# Altium project Sensor_PCB_S201.PrjPcb
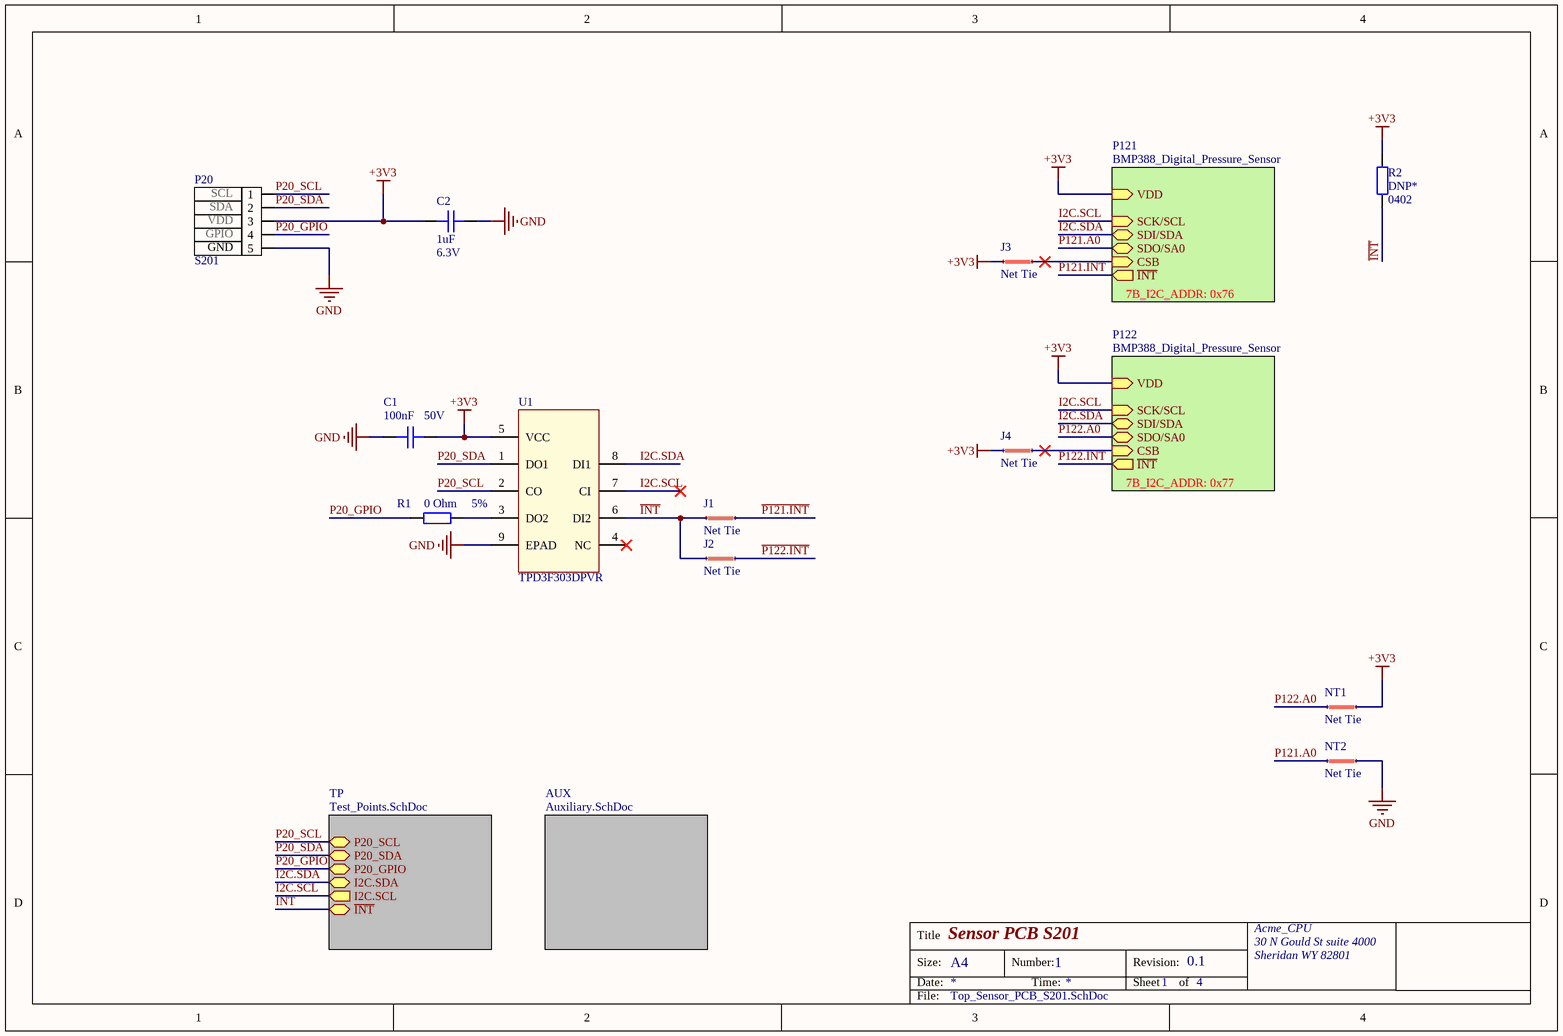
[diagram p0: Top_Sensor_PCB_S201.SchDoc]
_address1: 30 N Gould St suite 4000; _address2: Sheridan WY 82801; _ApprovedBy: PGU; _BoardName: Sensor_PCB; _CompanyName: Acme_CPU; _DateCode: 2020.30; _DocumentDate: 20201207; _HWEngineer: SGU; _PCBModel: S201; _PCBNumber: 001; _Revision: 0.1; _Title: Sensor_PCB; CompanyName: Acme CPU; Title: Sensor Board S201
3 sheets, 28 parts. Net scope: hierarchical (ports join the sheet entries above them; power ports are global).
Board files: Sensor_PCB_S201_Flex.PcbDoc, Sensor_PCB_S201_Flex_Sourav.PcbDoc
Sheets:
  Top_Sensor_PCB_S201.SchDoc
    TP = Test_Points.SchDoc
    AUX = Auxiliary.SchDoc

## Sheet Top_Sensor_PCB_S201.SchDoc: Sensor PCB S201
size A4; DocumentNumber: 1; SheetNumber: 1; SheetTotal: 4

### Parts
C1  Capacitance: 100nF  Voltage: 50V  [C0402]  (hidden comment: CAP CER 0.1UF 50V X7R 0402)
C2  Capacitance: 1uF  Voltage Rating: 6.3V  [C0402]  (hidden comment: CAP CER 1UF 6.3V X5R 0402)
J1  Net Tie  [Net Tie 6x30mil]  (net tie, no BOM)
J2  Net Tie  [Net Tie 6x30mil]  (net tie, no BOM)
J3  Net Tie  [Net Tie 6x30mil]  (net tie, no BOM)
J4  Net Tie  [Net Tie 6x30mil]  (net tie, no BOM)
NT1  Net Tie  [Net Tie 6x30mil]  (net tie, no BOM)
NT2  Net Tie  [Net Tie 6x30mil]  (net tie, no BOM)
P20  S201  pin_1: SCL  pin_2: SDA  pin_3: VDD  pin_4: GPIO  pin_5: GND  [5-PIN FPC BOARD EDGE CONNECTOR 0.5MM]
R1  Tolerance: 5%  Resistance: 0 Ohm  [R0402]  (hidden comment: RES SMD 0 OHM JUMPER 1/16W 0402)
R2  DNP*  Case/Package: 0402  [R0402]  (no BOM)
U1  TPD3F303DPVR  [DPV8_1P7X0P4]

### Sub-sheets
AUX = Auxiliary.SchDoc: no entries
P121 = BMP388_Digital_Pressure_Sensor (file not in this document): VDD (in), SCK/SCL (in), SDI/SDA (bidir), SDO/SA0 (bidir), CSB (in), ~{INT} (out)  | 7B_I2C_ADDR: 0x76
P122 = BMP388_Digital_Pressure_Sensor (file not in this document): VDD (in), SCK/SCL (in), SDI/SDA (bidir), SDO/SA0 (bidir), CSB (in), ~{INT} (out)  | 7B_I2C_ADDR: 0x77
TP = Test_Points.SchDoc: P20_SCL, P20_SDA, P20_GPIO, I2C.SDA (bidir), I2C.SCL (out), ~{INT}

### Nets
+3V3: C1.1 C2.2 J3.1 J4.1 NT1.2 P20.3 R2.2 U1.5(VCC) ; sheet P121/VDD, sheet P122/VDD
GND: C1.2 C2.1 NT2.2 P20.5 U1.9(EPAD)
~{INT}: J1.1 J2.1 R2.1 U1.6(DI2) ; sheet TP/~{INT}
~{P121.INT}: J1.2 ; sheet P121/~{INT}
~{P122.INT}: J2.2 ; sheet P122/~{INT}
I2C.SCL: U1.7(CI) ; sheet TP/I2C.SCL, sheet P121/SCK/SCL, sheet P122/SCK/SCL
I2C.SDA: U1.8(DI1) ; sheet TP/I2C.SDA, sheet P121/SDI/SDA, sheet P122/SDI/SDA
P20_GPIO: P20.4 R1.2 ; sheet TP/P20_GPIO
P20_SCL: P20.1 U1.2(CO) ; sheet TP/P20_SCL
P20_SDA: P20.2 U1.1(DO1) ; sheet TP/P20_SDA
P121.A0: NT2.1 ; sheet P121/SDO/SA0
P122.A0: NT1.1 ; sheet P122/SDO/SA0
NetJ3_2: J3.2 ; sheet P121/CSB
NetJ4_2: J4.2 ; sheet P122/CSB
NetR1_1: R1.1 U1.3(DO2)

Not connected (* = marked no-connect by the designer): U1 4(NC)*

### Notes on the sheet
- Title
- Size:
- Date:
- A4
- Number:
- Time:
- Revision:
- Sheet
- of
- File:

### Library data of the parts
C1 = CAP CER 0.1UF 50V X7R 0402: 0.1µF ±10% 50V Ceramic Capacitor X7R 0402 (1005 Metric); Manufacturer: TDK; Manufacturer Part Number: CGA2B3X7R1H104K050BB; Supplier 1: Digi-Key; Stock 1: 2925303; Pricing 1: 1=0.17, 10=0.118, 50=0.0668, 100=0.0553, 500=0.0388, 1000=0.0321, 2500=0.0299, 5000=0.0273 (USD); Mount: Surface Mount; Case/Package: 0402; Weight: 2.3E-05oz; Case Code (Metric): 1005; Case Code (Imperial): 0402; Min Operating Temperature: -55°C; Max Operating Temperature: 125°C; Voltage Rating: 50V; Tolerance: 10%; Packaging: Tape and Reel; Package Quantity: 1; Voltage Rating (DC): 50V; Dielectric: X7R; Termination: SMD/SMT; Composition: Ceramic; Length: 1mm; Height: 0.5mm; Width: 0.02inch; Thickness: 0.022inch; Depth: 0.5mm; Ratings: AEC-Q200; REACH SVHC: No SVHC; Lead Free: Lead Free; ComponentLink1URL: http://product.tdk.com/capacitor/mlcc/en/documents/mlccspec_automotive_general_midvoltage_en.pdf?src-supplier=Future+Electronics; ComponentLink1Description: http://product.tdk.com/capacitor/mlcc/en/documents/mlccspec_automotive_general_midvoltage_en.pdf?src-supplier=Future+Electronics; ComponentLink2URL: http://www.farnell.com/datasheets/1807242.pdf?src-supplier=Element14; ComponentLink2Description: http://www.farnell.com/datasheets/1807242.pdf?src-supplier=Element14; ComponentLink3URL: http://www.mouser.com/ds/2/400/lcc_automotive_general_en-843974.pdf?src-supplier=Mouser; ComponentLink3Description: http://www.mouser.com/ds/2/400/lcc_automotive_general_en-843974.pdf?src-supplier=Mouser; ComponentLink4URL: http://www.farnell.com/datasheets/1936565.pdf?src-supplier=Element14; ComponentLink4Description: http://www.farnell.com/datasheets/1936565.pdf?src-supplier=Element14; ComponentLink5URL: http://www.farnell.com/datasheets/1735392.pdf?src-supplier=Element14; ComponentLink5Description: http://www.farnell.com/datasheets/1735392.pdf?src-supplier=Element14; Supplier Part Number 1: 445-6899-1-ND
C2 = CAP CER 1UF 6.3V X5R 0402: 1µF ±10% 6.3V Ceramic Capacitor X5R 0402 (1005 Metric); Manufacturer: Yageo; Manufacturer Part Number: CC0402KRX5R5BB105; Supplier 1: Digi-Key; Stock 1: 34926286; Pricing 1: 1=0.1, 10=0.05, 50=0.0272, 100=0.0222, 500=0.0158, 1000=0.0124, 2500=0.0113, 5000=0.0104 (USD); Mount: Surface Mount; Number of Pins: 2; Case Code (Imperial): 0402; Case Code (Metric): 1005; Min Operating Temperature: -55°C; Max Operating Temperature: 85°C; Tolerance: 10%; Packaging: Tape and Reel; Termination: SMD/SMT; Voltage Rating (DC): 6.3V; Composition: Ceramic; Length: 1mm; Height: 0.5mm; Width: 0.02inch; Thickness: 0.022inch; Depth: 0.5mm; Radiation Hardening: No; Lead Free: Lead Free; Halogen Free: Halogen Free; ComponentLink1URL: http://www.farnell.com/datasheets/70765.pdf?src-supplier=Farnell; ComponentLink1Description: http://www.farnell.com/datasheets/70765.pdf?src-supplier=Farnell; Supplier Part Number 1: 311-1438-1-ND; Dielectric: X5R; Case/Package: 0402; Dielectric Material: Ceramic; Package Quantity: 1; REACH SVHC: No SVHC; ComponentLink2URL: http://www.yageo.com/documents/recent/UPY-GPHC_X5R_4V-to-50V_25.pdf?src-supplier=Digi-Key; ComponentLink2Description: http://www.yageo.com/documents/recent/UPY-GPHC_X5R_4V-to-50V_25.pdf?src-supplier=Digi-Key; ComponentLink3URL: http://www.farnell.com/datasheets/2167237.pdf?src-supplier=Element14; ComponentLink3Description: http://www.farnell.com/datasheets/2167237.pdf?src-supplier=Element14; ComponentLink4URL: http://www.yageo.com/documents/recent/UPY-GPHC_X5R_4V-to-50V_12.pdf?src-supplier=Avnet+Europe; ComponentLink4Description: http://www.yageo.com/documents/recent/UPY-GPHC_X5R_4V-to-50V_12.pdf?src-supplier=Avnet+Europe; ComponentLink5URL: http://www.farnell.com/datasheets/1359354.pdf?src-supplier=Element14; ComponentLink5Description: http://www.farnell.com/datasheets/1359354.pdf?src-supplier=Element14; ComponentLink6URL: http://www.farnell.com/datasheets/70765.pdf?src-supplier=Element14; ComponentLink6Description: http://www.farnell.com/datasheets/70765.pdf?src-supplier=Element14; ComponentLink7URL: http://www.yageo.com/documents/recent/UPY-GPHC_X5R_4V-to-50V_12.pdf?src-supplier=Avnet; ComponentLink7Description: http://www.yageo.com/documents/recent/UPY-GPHC_X5R_4V-to-50V_12.pdf?src-supplier=Avnet
J1-J4 NT1 NT2 = Net Tie Line
  J1-J4: ClassName: Net Tie
  NT1: ClassName: P122
  NT2: ClassName: P121
P20 = CONN HEADER TH R/A 5POS 1.5MM: Connector Header Through Hole, Right Angle 5 position 0.059" (1.50mm); Manufacturer: JST; Manufacturer Part Number: S5B-ZR(LF)(SN); Number of Positions: 5; Gender: Male; Pitch: 1.5mm; Connector Type: Male Pin; Current Rating: 1A; Voltage Rating: 50V; Contact Resistance: 30mR; Supplier 1: Digi-Key; Stock 1: 41138; Pricing 1: 1=0.29, 10=0.272, 100=0.1889, 500=0.1598, 1000=0.1308, 5000=0.1162, 10000=0.1053 (USD); Mount: Through Hole; Housing Material: Polyamide; Contact Plating: Tin,Copper; Color: Natural; Min Operating Temperature: -25°C; Max Operating Temperature: 85°C; Number of Rows: 1; Packaging: Bulk; Termination: Press-Fit; Orientation: Right Angle; Number of Contacts: 5; ComponentLink1URL: http://www.jst-mfg.com/product/pdf/eng/eZH.pdf?src-supplier=Digi-Key; ComponentLink1Description: http://www.jst-mfg.com/product/pdf/eng/eZH.pdf?src-supplier=Digi-Key; Supplier Part Number 1: 455-1672-ND; Housing Color: Beige; Fastening Type: Detent; Length: 9mm; Depth: 6mm; Contact Mating Length: 0.094inch; Number of Pins: 5; Contact Material: Brass,Tin; Max Current Rating: 1A; Max Voltage Rating (AC): 50V; Height: 7.2mm; Width: 3.5mm; Lead Free: Lead Free; ComponentLink2URL: https://www.verical.com/server-webapp/html/getDatasheet?partID=640593&src-supplier=Verical; ComponentLink2Description: https://www.verical.com/server-webapp/html/getDatasheet?partID=640593&src-supplier=Verical; ComponentLink3URL: http://www1.futureelectronics.com/doc/JST/S5B-ZR(LF)(SN).pdf?src-supplier=Future+Electronics; ComponentLink3Description: http://www1.futureelectronics.com/doc/JST/S5B-ZR(LF)(SN).pdf?src-supplier=Future+Electronics; ComponentLink4URL: http://www.produktinfo.conrad.com/datenblaetter/725000-749999/741204-da-01-en-STIFTLEISTE_GEWINKELT_5_POL_RM1_5.pdf?src-supplier=Conrad; ComponentLink4Description: http://www.produktinfo.conrad.com/datenblaetter/725000-749999/741204-da-01-en-STIFTLEISTE_GEWINKELT_5_POL_RM1_5.pdf?src-supplier=Conrad
R1 = RES SMD 0 OHM JUMPER 1/16W 0402: 0 Ohms Jumper 0.063W, 1/16W Chip Resistor 0402 (1005 Metric) Moisture Resistant Thick Film; Manufacturer: Yageo; Manufacturer Part Number: RC0402JR-070RL; Power Rating: 62.5mW; Voltage Rating: 50V; Max Power Dissipation: 63mW; Temperature Coefficient: 200ppm/°C; Supplier 1: Digi-Key; Stock 1: 46057148; Pricing 1: 1=0.1, 10=0.013, 25=0.0092, 50=0.0072, 100=0.0053, 250=0.004, 500=0.0032, 1000=0.0024, 5000=0.0017 (USD); Contact Plating: Tin,Matte; Case Code (Metric): 1005; Case Code (Imperial): 0402; Min Operating Temperature: -55°C; Max Operating Temperature: 155°C; Packaging: Tape and Reel; Composition: Thick Film; Package Quantity: 1; Number of Terminations: 2; Termination: SMD/SMT; Military Standard: Not; Features: Moisture Resistant; Length: 1mm; Height: 0.016inch; Width: 0.02inch; Depth: 0.5mm; Radiation Hardening: No; REACH SVHC: Unknown; Lead Free: Lead Free; ComponentLink1URL: http://www.yageo.com/documents/recent/PYu-RC_Group_51_RoHS_L_10.pdf?src-supplier=Digi-Key; ComponentLink1Description: http://www.yageo.com/documents/recent/PYu-RC_Group_51_RoHS_L_10.pdf?src-supplier=Digi-Key; ComponentLink2URL: http://www.yageo.com/documents/recent/PYu-RC0402_51_RoHS_L_6.pdf?src-supplier=Avnet+Europe; ComponentLink2Description: http://www.yageo.com/documents/recent/PYu-RC0402_51_RoHS_L_6.pdf?src-supplier=Avnet+Europe; ComponentLink3URL: http://www.farnell.com/datasheets/1018594.pdf?src-supplier=Element14; ComponentLink3Description: http://www.farnell.com/datasheets/1018594.pdf?src-supplier=Element14; ComponentLink4URL: https://www.verical.com/server-webapp/html/getDatasheet?partID=326379&src-supplier=Verical; ComponentLink4Description: https://www.verical.com/server-webapp/html/getDatasheet?partID=326379&src-supplier=Verical; ComponentLink5URL: http://www.farnell.com/datasheets/2167052.pdf?src-supplier=Element14; ComponentLink5Description: http://www.farnell.com/datasheets/2167052.pdf?src-supplier=Element14; Supplier Part Number 1: 311-0.0JRCT-ND; Case/Package: 0402
R2 = RES SMD NO BOM 0402: Placeholder for a 0402 resistor
U1 = FILTER RC(PI) ESD SMD  8-UFDFN EP: RC (Pi) EMI Filter 2nd Order Low Pass 3 Channel R = 47Ohms, 100Ohms, C = 20pF  8-UFDFN Exposed Pad; Manufacturer: Texas Instruments; Number of Channels: 3; Operating Supply Voltage: 5.5V; ESD Protection: Yes; Clamping Voltage: 10V; Frequency: 308MHz; Supplier 1: Digi-Key; Manufacturer Part Number: TPD3F303DPVR; Stock 1: 4896; Pricing 1: 1=0.85, 10=0.812, 25=0.7856, 50=0.6414, 100=0.576, 250=0.5236, 500=0.4974, 1000=0.4451 (USD); Case/Package: SMD/SMT; Number of Pins: 8; Contact Plating: Gold; Min Operating Temperature: -40°C; Max Operating Temperature: 85°C; Package Quantity: 1; Packaging: Tape and Reel; Capacitance: 20pF; Termination: Flat; Length: 2.2mm; Height: 0.026inch; Width: 0.063inch; Depth: 1.7mm; Radiation Hardening: No; REACH SVHC: No SVHC; Lead Free: Lead Free; ComponentLink1URL: http://www.ti.com/lit/ds/symlink/tpd3f303.pdf?src-supplier=Digi-Key; ComponentLink1Description: http://www.ti.com/lit/ds/symlink/tpd3f303.pdf?src-supplier=Digi-Key; ComponentLink2URL: http://focus.ti.com/lit/ds/symlink/tpd3f303.pdf?src-supplier=Avnet+Europe; ComponentLink2Description: http://focus.ti.com/lit/ds/symlink/tpd3f303.pdf?src-supplier=Avnet+Europe; ComponentLink3URL: https://www.verical.com/server-webapp/html/getDatasheet?partID=302817&src-supplier=Verical; ComponentLink3Description: https://www.verical.com/server-webapp/html/getDatasheet?partID=302817&src-supplier=Verical; ComponentLink4URL: http://www.farnell.com/datasheets/1558442.pdf?src-supplier=Element14; ComponentLink4Description: http://www.farnell.com/datasheets/1558442.pdf?src-supplier=Element14; Supplier Part Number 1: 296-28299-1-ND

## Sheet Test_Points.SchDoc: Test Points
size A4; DocumentNumber: 2; SheetNumber: 2; SheetTotal: 4
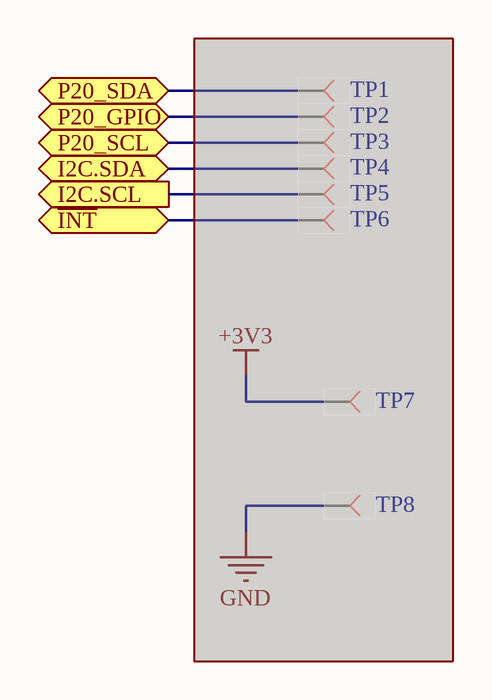
[diagram p1: Test_Points.SchDoc]

### Parts
TP1  Test Point Pad  [Testpoint]  (value not drawn)  (no BOM)  (masked out: inside a compile mask, not in the netlist)
TP2  Test Point Pad  [Testpoint]  (value not drawn)  (no BOM)  (masked out: inside a compile mask, not in the netlist)
TP3  Test Point Pad  [Testpoint]  (value not drawn)  (no BOM)  (masked out: inside a compile mask, not in the netlist)
TP4  Test Point Pad  [Testpoint]  (value not drawn)  (no BOM)  (masked out: inside a compile mask, not in the netlist)
TP5  Test Point Pad  [Testpoint]  (value not drawn)  (no BOM)  (masked out: inside a compile mask, not in the netlist)
TP6  Test Point Pad  [Testpoint]  (value not drawn)  (no BOM)  (masked out: inside a compile mask, not in the netlist)
TP7  Test Point Pad  [Testpoint]  (value not drawn)  (no BOM)  (masked out: inside a compile mask, not in the netlist)
TP8  Test Point Pad  [Testpoint]  (value not drawn)  (no BOM)  (masked out: inside a compile mask, not in the netlist)

### Ports
I2C.SCL (out), I2C.SDA (bidir), P20_GPIO, P20_SCL, P20_SDA, ~{INT}

### Notes on the sheet
- Title
- Size:
- Date:
- A4
- Number:
- Time:
- Revision:
- Sheet
- of
- File:

### Library data of the parts
TP1-TP8 = Test Point Pad: Test Point. There is nothing to buy or mount.; ClassName: TestPoint; CompType: TestPoint; Manufacturer: N/A; MountType: N/A; PackageReference: TetsPoint; PartNumber: N/A

## Sheet Auxiliary.SchDoc: Auxiliary Components
size A4; DocumentNumber: 3; SheetNumber: 3; SheetTotal: 4
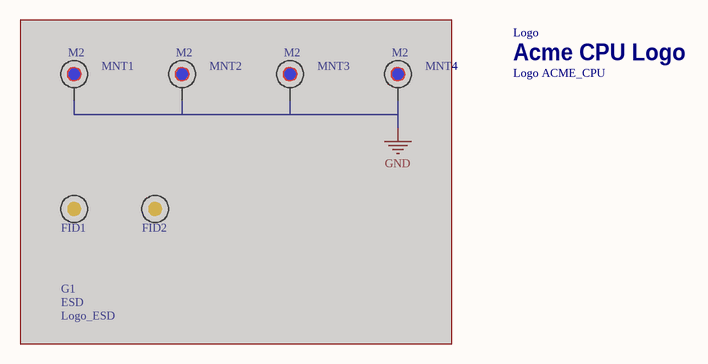
[diagram p2: Auxiliary.SchDoc]

### Parts
FID1  N/A  [Fiducial]  (value not drawn)  (no BOM)  (masked out: inside a compile mask, not in the netlist)
FID2  N/A  [Fiducial]  (value not drawn)  (no BOM)  (masked out: inside a compile mask, not in the netlist)
G1  Logo_ESD  [Logo_ESD]  (no BOM)  (masked out: inside a compile mask, not in the netlist)
Logo  Logo ACME_CPU  [LOGO_ACME_CPU]  (no BOM)
MNT1  MountHole M2. Nothing to buy or mount  [MountHole_M2]  (value not drawn)  (no BOM)  (masked out: inside a compile mask, not in the netlist)
MNT2  MountHole M2. Nothing to buy or mount  [MountHole_M2]  (value not drawn)  (no BOM)  (masked out: inside a compile mask, not in the netlist)
MNT3  MountHole M2. Nothing to buy or mount  [MountHole_M2]  (value not drawn)  (no BOM)  (masked out: inside a compile mask, not in the netlist)
MNT4  MountHole M2. Nothing to buy or mount  [MountHole_M2]  (value not drawn)  (no BOM)  (masked out: inside a compile mask, not in the netlist)

### Notes on the sheet
- Title
- Size:
- Date:
- A4
- Number:
- Time:
- Revision:
- Sheet
- of
- File:
- (in symbol Logo ACME_CPU) Acme CPU Logo
- (in symbol Logo_ESD) ESD
- (in symbol MountHole_M2) M2

### Library data of the parts
FID1 FID2 = Fiducial: Fiducial mark.  There is nothing to buy or mount.; ClassName: FiducialMark; CompType: Fiducial; Manufacturer: N/A; MountType: N/A; PackageReference: Fiducial; Manufacturer Part Number: N/A
MNT1-MNT4 = MountHole_M2: PCB Mount Hole. There is nothing to buy or mount.
Logo = Logo ACME_CPU: ClassName: PCB_FEATURE

## Assembly variants
Default: all parts fitted